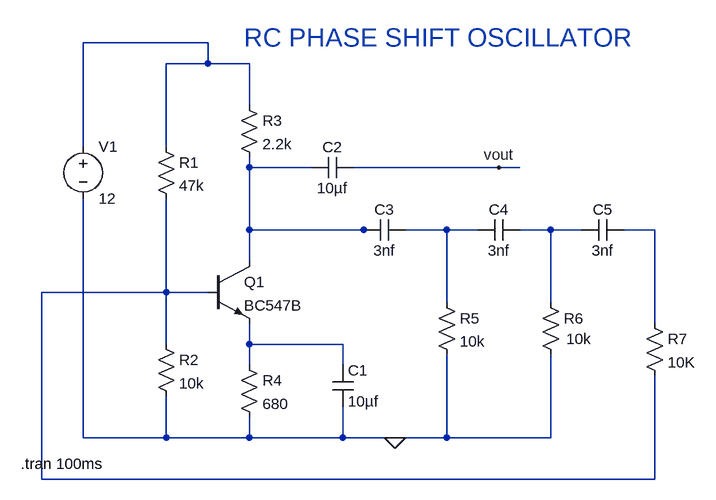
[diagram p0: schematic phaseOscltr1.asc]
phaseOscltr1.asc, the LTspice schematic file:
Version 4
SHEET 1 1060 680
WIRE 192 -160 0 -160
WIRE 192 -128 192 -160
WIRE 192 -128 128 -128
WIRE 256 -128 192 -128
WIRE 256 -64 256 -128
WIRE 0 0 0 -160
WIRE 128 0 128 -128
WIRE 256 32 256 16
WIRE 352 32 256 32
WIRE 640 32 416 32
WIRE 672 32 640 32
WIRE 256 128 256 32
WIRE 432 128 256 128
WIRE 448 128 432 128
WIRE 560 128 496 128
WIRE 608 128 560 128
WIRE 720 128 672 128
WIRE 768 128 720 128
WIRE 880 128 832 128
WIRE 256 176 256 128
WIRE 128 224 128 80
WIRE 128 224 -64 224
WIRE 192 224 128 224
WIRE 560 240 560 128
WIRE 720 240 720 128
WIRE 880 272 880 128
WIRE 128 304 128 224
WIRE 256 304 256 272
WIRE 400 304 256 304
WIRE 256 336 256 304
WIRE 400 336 400 304
WIRE 0 448 0 80
WIRE 128 448 128 384
WIRE 128 448 0 448
WIRE 256 448 256 416
WIRE 256 448 128 448
WIRE 400 448 400 400
WIRE 400 448 256 448
WIRE 480 448 400 448
WIRE 560 448 560 320
WIRE 560 448 480 448
WIRE 720 448 720 320
WIRE 720 448 560 448
WIRE -64 512 -64 224
WIRE 880 512 880 352
WIRE 880 512 -64 512
FLAG 640 32 vout
FLAG 480 448 0
SYMBOL res 112 -16 R0
SYMATTR InstName R1
SYMATTR Value 47k
SYMBOL res 112 288 R0
SYMATTR InstName R2
SYMATTR Value 10k
SYMBOL res 240 320 R0
SYMATTR InstName R4
SYMATTR Value 680
SYMBOL cap 384 336 R0
SYMATTR InstName C1
SYMATTR Value 10µf
SYMBOL cap 416 16 R90
WINDOW 0 0 32 VBottom 2
WINDOW 3 32 32 VTop 2
SYMATTR InstName C2
SYMATTR Value 10µf
SYMBOL cap 496 112 R90
WINDOW 0 0 32 VBottom 2
WINDOW 3 32 32 VTop 2
SYMATTR InstName C3
SYMATTR Value 3nf
SYMBOL cap 672 112 R90
WINDOW 0 0 32 VBottom 2
WINDOW 3 32 32 VTop 2
SYMATTR InstName C4
SYMATTR Value 3nf
SYMBOL cap 832 112 R90
WINDOW 0 0 32 VBottom 2
WINDOW 3 32 32 VTop 2
SYMATTR InstName C5
SYMATTR Value 3nf
SYMBOL res 240 -80 R0
SYMATTR InstName R3
SYMATTR Value 2.2k
SYMBOL res 544 224 R0
SYMATTR InstName R5
SYMATTR Value 10k
SYMBOL res 704 224 R0
WINDOW 3 40 72 Left 2
SYMATTR Value 10k
SYMATTR InstName R6
SYMBOL npn 192 176 R0
SYMATTR InstName Q1
SYMATTR Value BC547B
SYMBOL res 864 256 R0
SYMATTR InstName R7
SYMATTR Value 10K
SYMBOL voltage 0 -16 R0
WINDOW 123 0 0 Left 0
WINDOW 39 0 0 Left 0
SYMATTR InstName V1
SYMATTR Value 12
TEXT -96 488 Left 2 !.tran 100ms
TEXT 248 -168 Left 4 ;RC PHASE SHIFT OSCILLATOR

The netlist it stands for:
* phaseOscltr1.asc
R1 N001 N006 47k
R2 N006 0 10k
R4 N007 0 680
C1 N007 0 10µf
C2 vout N002 10µf
C3 N003 N002 3nf
C4 N004 N003 3nf
C5 N005 N004 3nf
R3 N001 N002 2.2k
R5 N003 0 10k
R6 N004 0 10k
Q1 N002 N006 N007 0 BC547B
R7 N005 N006 10K
V1 N001 0 12
.model NPN NPN
.model PNP PNP
.lib standard.bjt
.tran 100ms
* RC PHASE SHIFT OSCILLATOR
.backanno
.end